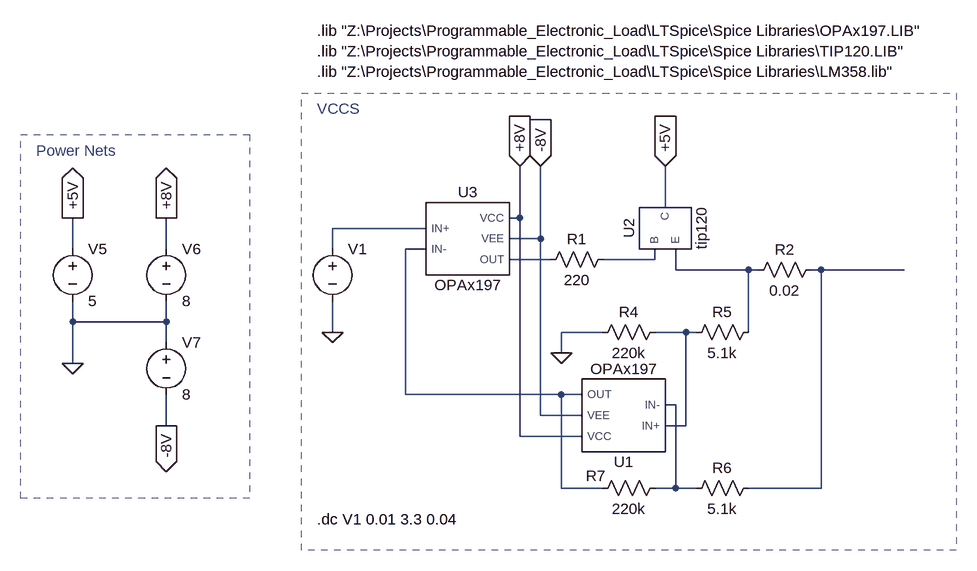
[diagram p0: schematic MJ15024_Tester.asc]
MJ15024_Tester.asc, the LTspice schematic file:
Version 4
SHEET 1 1476 776
WIRE 656 240 656 176
WIRE 432 256 432 176
WIRE 432 256 416 256
WIRE 288 272 144 272
WIRE 464 288 464 176
WIRE 464 288 416 288
WIRE -256 304 -256 256
WIRE -112 304 -112 256
WIRE 144 304 144 272
WIRE 288 304 256 304
WIRE 480 320 416 320
WIRE 640 320 640 304
WIRE 640 320 560 320
WIRE 672 336 672 304
WIRE 784 336 672 336
WIRE 800 336 784 336
WIRE 896 336 880 336
WIRE 1024 336 896 336
WIRE -256 416 -256 384
WIRE -112 416 -112 384
WIRE -112 416 -256 416
WIRE 144 432 144 384
WIRE 560 432 496 432
WIRE 688 432 640 432
WIRE 704 432 688 432
WIRE 784 432 784 336
WIRE -112 448 -112 416
WIRE 496 464 496 432
WIRE -256 480 -256 416
WIRE 256 528 256 304
WIRE 496 528 256 528
WIRE 528 528 496 528
WIRE 672 544 656 544
WIRE 464 560 464 288
WIRE 528 560 464 560
WIRE -112 576 -112 528
WIRE 688 576 688 432
WIRE 688 576 656 576
WIRE 432 592 432 256
WIRE 528 592 432 592
WIRE 496 672 496 528
WIRE 560 672 496 672
WIRE 672 672 672 544
WIRE 672 672 640 672
WIRE 704 672 672 672
WIRE 896 672 896 336
WIRE 896 672 784 672
FLAG 496 464 0
FLAG 144 432 0
FLAG -256 480 0
FLAG -256 256 +5V
IOPIN -256 256 Out
FLAG 656 176 +5V
IOPIN 656 176 In
FLAG -112 256 +8V
IOPIN -112 256 Out
FLAG -112 576 -8V
IOPIN -112 576 Out
FLAG 432 176 +8V
IOPIN 432 176 In
FLAG 464 176 -8V
IOPIN 464 176 In
SYMBOL OPAx197 592 560 R180
SYMATTR InstName U1
SYMBOL tip120 656 272 M90
SYMATTR InstName U2
SYMBOL res 576 304 R90
WINDOW 0 0 56 VBottom 2
WINDOW 3 32 56 VTop 2
SYMATTR InstName R1
SYMATTR Value 220
SYMBOL res 896 320 R90
WINDOW 0 0 56 VBottom 2
WINDOW 3 32 56 VTop 2
SYMATTR InstName R2
SYMATTR Value 0.02
SYMBOL res 656 416 R90
WINDOW 0 0 56 VBottom 2
WINDOW 3 32 56 VTop 2
SYMATTR InstName R4
SYMATTR Value 220k
SYMBOL res 800 416 R90
WINDOW 0 0 56 VBottom 2
WINDOW 3 32 56 VTop 2
SYMATTR InstName R5
SYMATTR Value 5.1k
SYMBOL res 800 656 R90
WINDOW 0 0 56 VBottom 2
WINDOW 3 32 56 VTop 2
SYMATTR InstName R6
SYMATTR Value 5.1k
SYMBOL res 656 656 R90
WINDOW 0 13 107 VBottom 2
WINDOW 3 32 56 VTop 2
SYMATTR InstName R7
SYMATTR Value 220k
SYMBOL voltage 144 288 R0
WINDOW 123 0 0 Left 0
WINDOW 39 0 0 Left 0
SYMATTR InstName V1
SYMATTR Value ""
SYMBOL OPAx197 352 288 R0
SYMATTR InstName U3
SYMBOL voltage -256 288 R0
WINDOW 123 0 0 Left 0
WINDOW 39 0 0 Left 0
SYMATTR InstName V5
SYMATTR Value 5
SYMBOL voltage -112 288 R0
WINDOW 123 0 0 Left 0
WINDOW 39 0 0 Left 0
SYMATTR InstName V6
SYMATTR Value 8
SYMBOL voltage -112 432 R0
WINDOW 123 0 0 Left 0
WINDOW 39 0 0 Left 0
SYMATTR InstName V7
SYMATTR Value 8
TEXT 120 -32 Left 2 !.lib "Z:\\Projects\\Programmable_Electronic_Load\\LTSpice\\Spice Libraries\\OPAx197.LIB"\n.lib "Z:\\Projects\\Programmable_Electronic_Load\\LTSpice\\Spice Libraries\\TIP120.LIB"\n.lib "Z:\\Projects\\Programmable_Electronic_Load\\LTSpice\\Spice Libraries\\LM358.lib"
TEXT 120 720 Left 2 !.dc V1 0.01 3.3 0.04
TEXT 120 88 Left 2 ;VCCS
TEXT -312 152 Left 2 ;Power Nets
RECTANGLE Normal 16 688 -336 128 2
RECTANGLE Normal 1104 768 96 64 2

The netlist it stands for:
* MJ15024_Tester.asc
XU1 N007 N008 +8V -8V N002 OPAx197  ; pins IN+ IN- VCC VEE OUT
XU2 +5V N004 N005 tip120  ; pins C B E
R1 N004 N003 220
R2 N006 N005 0.02
R4 N007 0 220k
R5 N005 N007 5.1k
R6 N006 N008 5.1k
R7 N008 N002 220k
V1 N001 0
XU3 N001 N002 +8V -8V N003 OPAx197  ; pins IN+ IN- VCC VEE OUT
V5 +5V 0 5
V6 +8V 0 8
V7 0 -8V 8
.lib "Z:\Projects\Programmable_Electronic_Load\LTSpice\Spice Libraries\OPAx197.LIB"
.lib "Z:\Projects\Programmable_Electronic_Load\LTSpice\Spice Libraries\TIP120.LIB"
.lib "Z:\Projects\Programmable_Electronic_Load\LTSpice\Spice Libraries\LM358.lib"
.dc V1 0.01 3.3 0.04
* VCCS
* Power Nets
.lib Z:\Projects\Programmable_Electronic_Load\LTSpice\Test Setups\VCCS\OPAx197.LIB
.lib Z:\Projects\Programmable_Electronic_Load\LTSpice\Test Setups\VCCS\TIP120.LIB
.backanno
.end